# Altium schematic sheet RJ45.SchDoc: =project_title
size Tabloid; CompanyName: Luxonis Holding; Organization: Luxonis Holding; Address1: 1925 Harmony Park Drive; Address2: Westminster, CO; Address3: 80234; Address4: United States; SheetNumber: 8; SheetTotal: 12
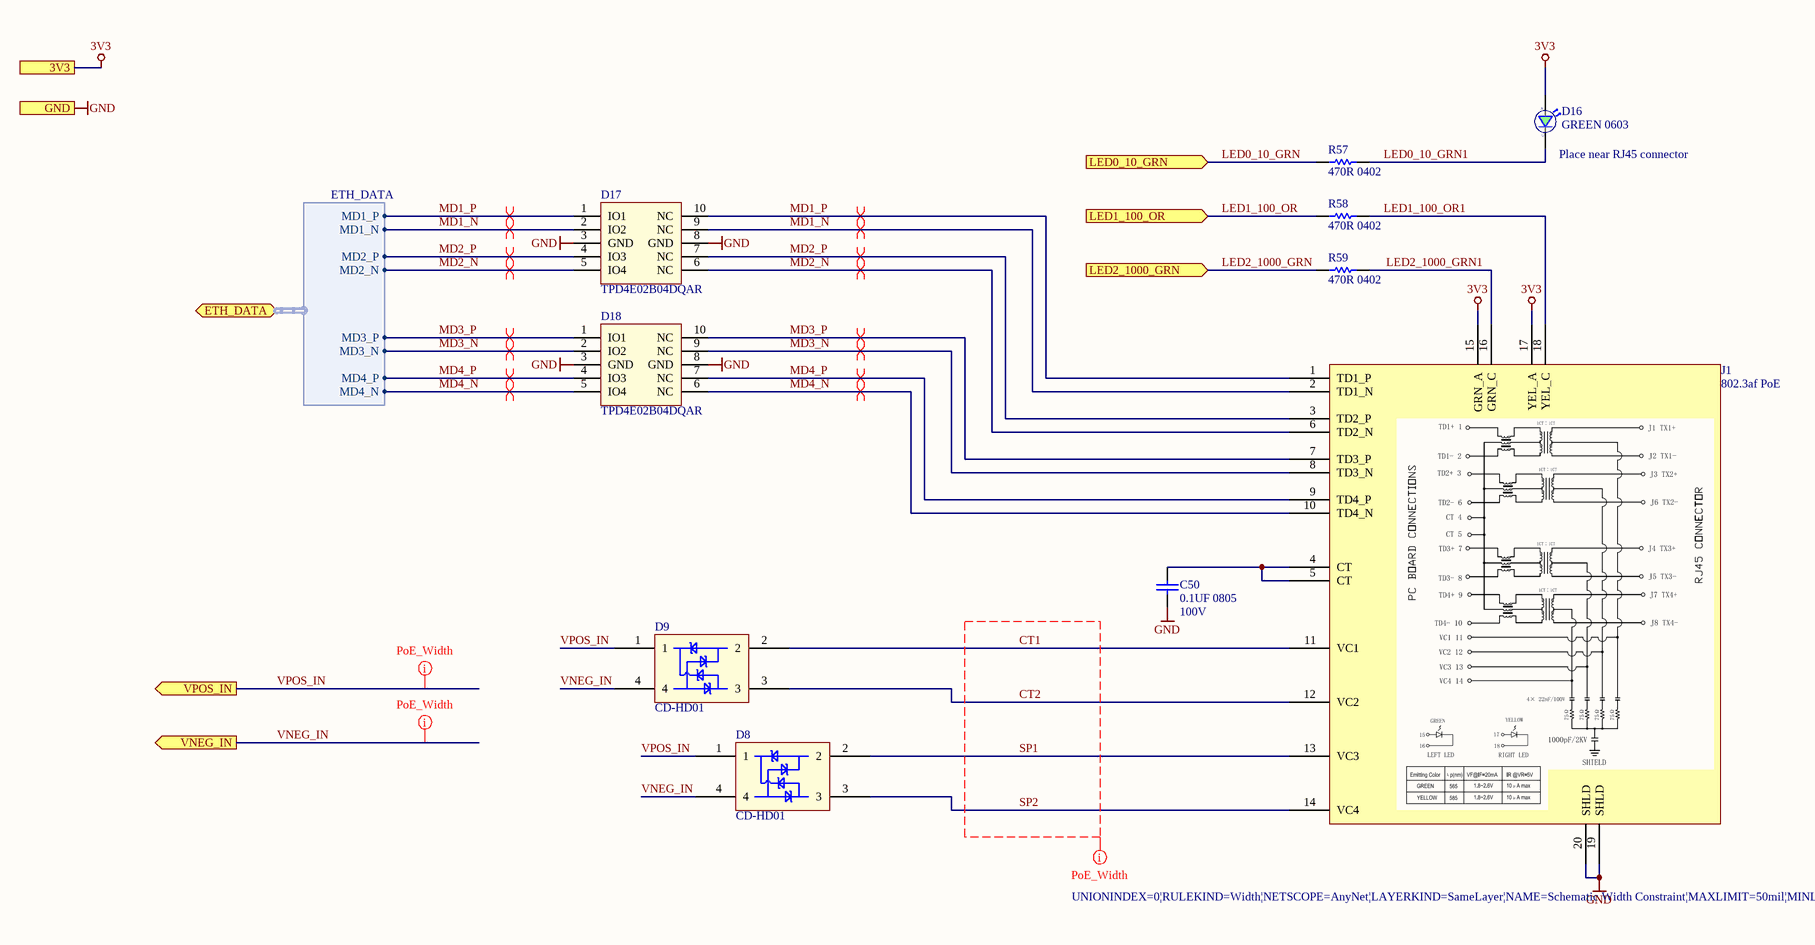
[diagram p0: RJ45.SchDoc]

## Parts
C50  0.1UF 0805  Voltage Rating: 100V  [CAPC0805(2012)145_N]
D8  CD-HD01  [CD-H01]
D9  CD-HD01  [CD-H01]
D16  GREEN 0603  [SML_D1xx8W]
D17  TPD4E02B04DQAR  [TPD4E02B04DQAR]
D18  TPD4E02B04DQAR  [TPD4E02B04DQAR]
J1  802.3af PoE  [TRJG0926HENL]
R57  470R 0402  [RESC0402(1005)_N]
R58  470R 0402  [RESC0402(1005)_N]
R59  470R 0402  [RESC0402(1005)_N]

## Ports
3V3, ETH_DATA (bidir, harness ETH_DATA), GND, LED0_10_GRN (in), LED1_100_OR (in), LED2_1000_GRN (in), VNEG_IN (out), VPOS_IN (out)

## Harnesses
ETH_DATA: MD1_P, MD1_N, MD2_P, MD2_N, MD3_P, MD3_N, MD4_P, MD4_N

## Nets
3V3: D16.2(A) J1.15(GRN_A) J1.17(YEL_A) ; port 3V3
GND: C50.1 D17.3(GND) D17.8(GND) D18.3(GND) D18.8(GND) J1.19(SHLD) J1.20(SHLD) ; port GND
CT1: D9.2 J1.11(VC1)
CT2: D9.3 J1.12(VC2)
LED0_10_GRN: R57.1 ; port LED0_10_GRN
LED0_10_GRN1: D16.1(C) R57.2
LED1_100_OR: R58.1 ; port LED1_100_OR
LED1_100_OR1: J1.18(YEL_C) R58.2
LED2_1000_GRN: R59.1 ; port LED2_1000_GRN
LED2_1000_GRN1: J1.16(GRN_C) R59.2
MD1_N: D17.2(IO2) D17.9(NC) J1.2(TD1_N) ; port ETH_DATA.MD1_N
MD1_P: D17.1(IO1) D17.10(NC) J1.1(TD1_P) ; port ETH_DATA.MD1_P
MD2_N: D17.5(IO4) D17.6(NC) J1.6(TD2_N) ; port ETH_DATA.MD2_N
MD2_P: D17.4(IO3) D17.7(NC) J1.3(TD2_P) ; port ETH_DATA.MD2_P
MD3_N: D18.2(IO2) D18.9(NC) J1.8(TD3_N) ; port ETH_DATA.MD3_N
MD3_P: D18.1(IO1) D18.10(NC) J1.7(TD3_P) ; port ETH_DATA.MD3_P
MD4_N: D18.5(IO4) D18.6(NC) J1.10(TD4_N) ; port ETH_DATA.MD4_N
MD4_P: D18.4(IO3) D18.7(NC) J1.9(TD4_P) ; port ETH_DATA.MD4_P
SP1: D8.2 J1.13(VC3)
SP2: D8.3 J1.14(VC4)
VNEG_IN: D8.4 D9.4 ; port VNEG_IN
VPOS_IN: D8.1 D9.1 ; port VPOS_IN
NetC50_2: C50.2 J1.4(CT) J1.5(CT)

## Layout directives
differential pair; net class ETH; differential pair class 100ohm: MD1_N, MD1_P, MD2_N, MD2_P, MD3_N, MD3_P, MD4_N, MD4_P
rule Width Constraint [Pref Width = 15mil    Min Width = 4mil    Max Width = 50mil]; net class PoE: CT1, CT2, SP1, SP2, VNEG_IN, VPOS_IN

## Notes on the sheet
- (near D16) Place near RJ45 connector
- Title
- Size:
- Date:
- Tabloid
- Number:
- Time:
- Revision:
- Sheet
- of
- Drawn by:

## Library data of the parts
C50 = CL21B104KCFNNNE: CAP CER 0.1UF 100V X7R 0805; Manufacturer 1: Samsung; Tolerance: 10%; Capacitance: 100nF; Supplier 1: Digi-Key; Manufacturer Part Number 1: CL21B104KCFNNNE; Stock 1: 93036; Pricing 1: 1=0.10000, 10=0.06800, 100=0.03050, 500=0.02180, 1000=0.01712 (USD); RoHS: Yes; Mount: Surface Mount; Case/Package: 0805; Case Code (Metric): 2012; Case Code (Imperial): 0805; Min Operating Temperature: -55°C; Max Operating Temperature: 125°C; Packaging: Tape and Reel; Dielectric: X7R; Length: 2mm; Width: 0.049inch; Thickness: 0.053inch; Depth: 1.25mm; Radiation Hardening: No; ComponentLink1URL: https://datasheet.ciiva.com/26936/getdatasheetpartid-781823-26936904.pdf?src-supplier=Verical; ComponentLink1Description: https://datasheet.ciiva.com/26936/getdatasheetpartid-781823-26936904.pdf?src-supplier=Verical; Supplier 2: Newark; Supplier 3: Future Electronics; Supplier Part Number 3: CL21B104KCFNNNE-CUTT; Supplier Part Number 2: 82AC9430; Supplier Part Number 1: 1276-6840-1-ND
D8 D9 = CD-HD01: CD-HD0x Series Schottky Bridge Rectifier Diode 100V 4-Pin Surface Mount T/R; Manufacturer: Bourns; Average Rectified Current: 1A; Supplier 1: Digi-Key; Manufacturer Part Number: CD-HD01; RoHS: No; Stock 1: 15383; Pricing 1: 1=0.61000, 10=0.52500, 100=0.36400, 500=0.28420, 1000=0.23100, 2000=0.21700 (USD); Mount: Surface Mount; Min Operating Temperature: -55°C; Max Operating Temperature: 125°C; Packaging: Tape and Reel; ComponentLink1URL: http://www.farnell.com/datasheets/2176057.pdf?src-supplier=Farnell; ComponentLink1Description: http://www.farnell.com/datasheets/2176057.pdf?src-supplier=Farnell; ComponentLink2URL: https://www.bourns.com/docs/Product-Datasheets/cd-hd0x.pdf?src-supplier=Digi-Key; ComponentLink2Description: https://www.bourns.com/docs/Product-Datasheets/cd-hd0x.pdf?src-supplier=Digi-Key; Supplier Part Number 1: CD-HD01CT-ND; Manufacturer 1: Bourns; Manufacturer Part Number 1: CD-HD01
D16 = SML-D12M8WT86: LED GREEN DIFFUSED 0603 SMD Green 572nm LED Indication - Discrete 2.2V 0603 (1608 Metric); Manufacturer: Rohm; Colour: Green,Yellow; Lens Colour: White,Clear,Diffused; Lens Style: Diffused,Colorless,Rectangular; Forward Current: 20mA; Luminous Intensity: 25mcd; Number of LEDs: 1; Viewing Angle: 160°; Lens Color: White,Diffused; Mount: Surface Mount; Case/Package: 0603; Number of Pins: 2; Case Code (Metric): 1608; Case Code (Imperial): 0603; Min Operating Temperature: -40°C; Max Operating Temperature: 85°C; Forward Voltage: 2.2V; Packaging: Tape and Reel; Dominant Wavelength: 572nm; Wavelength: 572nm; Illumination Colour: Green; Package Quantity: 1; Test Current: 20mA; Lens Transparency: Diffused; Length: 1.6mm; Height: 0.65mm; Width: 0.8mm; Radiation Hardening: No; REACH SVHC: Unknown; Lead Free: Lead Free; ComponentLink1URL: https://datasheet.ciiva.com/11774/0900766b80df3ada-11774260.pdf; ComponentLink1Description: https://datasheet.ciiva.com/11774/0900766b80df3ada-11774260.pdf; ComponentLink2URL: https://datasheet.ciiva.com/3161/sml-d1-3161419.pdf; ComponentLink2Description: https://datasheet.ciiva.com/3161/sml-d1-3161419.pdf; ComponentLink3URL: https://datasheet.ciiva.com/2110/sml-d1-2110396.pdf; ComponentLink3Description: https://datasheet.ciiva.com/2110/sml-d1-2110396.pdf; ComponentLink4URL: https://datasheet.ciiva.com/2110/sml-d1-2110397.pdf; ComponentLink4Description: https://datasheet.ciiva.com/2110/sml-d1-2110397.pdf; ComponentLink5URL: https://datasheet.ciiva.com/2110/sml-d1-2110398.pdf; ComponentLink5Description: https://datasheet.ciiva.com/2110/sml-d1-2110398.pdf; Manufacturer Part Number: SML-D12M8WT86; Supplier 1: Digi-Key; Manufacturer 1: Rohm; Manufacturer Part Number 1: SML-D12M8WT86; Stock 1: 112971; Pricing 1: 1=0.33000, 10=0.23900, 100=0.11340, 500=0.07560, 1000=0.05922 (USD); RoHS: Yes; Color: Green,Yellow; Illumination Color: Green; ComponentLink6URL: https://datasheet.ciiva.com/11774/0900766b80df3ada-11774260.pdf?src-supplier=RSComponents; ComponentLink6Description: https://datasheet.ciiva.com/11774/0900766b80df3ada-11774260.pdf?src-supplier=RSComponents; ComponentLink7URL: https://datasheet.ciiva.com/3161/sml-d1-3161419.pdf?src-supplier=Avnet; ComponentLink7Description: https://datasheet.ciiva.com/3161/sml-d1-3161419.pdf?src-supplier=Avnet; ComponentLink8URL: https://datasheet.ciiva.com/2110/sml-d1-2110396.pdf?src-supplier=Digi-Key; ComponentLink8Description: https://datasheet.ciiva.com/2110/sml-d1-2110396.pdf?src-supplier=Digi-Key; ComponentLink9URL: https://datasheet.ciiva.com/2110/sml-d1-2110397.pdf?src-supplier=Digi-Key; ComponentLink9Description: https://datasheet.ciiva.com/2110/sml-d1-2110397.pdf?src-supplier=Digi-Key; ComponentLink10URL: https://datasheet.ciiva.com/2110/sml-d1-2110398.pdf?src-supplier=Digi-Key; ComponentLink10Description: https://datasheet.ciiva.com/2110/sml-d1-2110398.pdf?src-supplier=Digi-Key; Supplier Part Number 1: 511-1578-1-ND
D17 D18 = TPD4E02B04DQAR: TVS DIODE 3.6V 8.8V 10USON 8.8V (Typ) Clamp 5A (8/20µs) Ipp Tvs Diode Surface Mount 10-USON (2.5x1); Manufacturer 1: Texas Instruments; Number of Bidirectional Channels: 4; Min Breakdown Voltage: 5.5V; Peak Pulse Power: 17W; Power Line Protection: No; Interface: USB,HDMI; Supplier 1: Digi-Key; Manufacturer Part Number 1: TPD4E02B04DQAR; Stock 1: 25615; Pricing 1: 1=0.69000, 10=0.60800, 100=0.46650, 500=0.36874, 1000=0.29499 (USD); RoHS: Yes; Mount: Surface Mount; Number of Pins: 10; Min Operating Temperature: -40°C; Max Operating Temperature: 125°C; Packaging: Cut Tape; Reverse Standoff Voltage: 3.6V; Clamping Voltage: 8.8V; Operating Supply Voltage: 3.6V; Peak Pulse Current: 5A; Number of Channels: 4; Composition: Zener; REACH SVHC: No SVHC; Lead Free: Lead Free; ComponentLink1URL: http://www.ti.com/general/docs/lit/getliterature.tsp?genericPartNumber=TPD4E02B04&amp;&amp;fileType=pdf&src-supplier=Element14; ComponentLink1Description: http://www.ti.com/general/docs/lit/getliterature.tsp?genericPartNumber=TPD4E02B04&amp;&amp;fileType=pdf&src-supplier=Element14; ComponentLink2URL: http://www.ti.com/lit/ds/symlink/tpd4e02b04.pdf?src-supplier=Farnell; ComponentLink2Description: http://www.ti.com/lit/ds/symlink/tpd4e02b04.pdf?src-supplier=Farnell; ComponentLink3URL: http://www.ti.com/lit/ds/symlink/tpd4e02b04.pdf?src-supplier=Newark; ComponentLink3Description: http://www.ti.com/lit/ds/symlink/tpd4e02b04.pdf?src-supplier=Newark; ComponentLink4URL: http://www.ti.com/lit/ds/symlink/tpd4e02b04.pdf?src-supplier=Digi-Key; ComponentLink4Description: http://www.ti.com/lit/ds/symlink/tpd4e02b04.pdf?src-supplier=Digi-Key; Supplier Part Number 1: 296-43875-1-ND
J1 = TRJG0926HENL: CONN MAGJACK 1PORT 1000 BASET; Manufacturer 1: Trxcom; System: Connector; Manufacturer Part Number 1: TRJG0926HENL; Supplier 1: Trxcom; Supplier Part Number 1: TRJG0926HENL
R57-R59 = CRCW0402470RFKED: RES SMD 470 OHM 1% 1/16W 0402; Manufacturer 1: Vishay; Temperature Coefficient: 100ppm/°C; Power Rating: 63mW; Voltage Rating: 50V; Supplier 1: Digi-Key; Manufacturer Part Number 1: CRCW0402470RFKED; Stock 1: 9199; Pricing 1: 1=0.10000, 10=0.03800, 100=0.01540, 1000=0.00690, 2500=0.00599, 5000=0.00495 (USD); RoHS: Yes; Case/Package: 0402; Weight: 2.3E-05oz; Case Code (Imperial): 0402; Case Code (Metric): 1005; Min Operating Temperature: -55°C; Max Operating Temperature: 155°C; Packaging: Tape and Reel; Resistance: 470R; Tolerance: 1%; Composition: Thick Film; Voltage Rating (DC): 50V; Termination: SMD/SMT; Military Standard: Not; Length: 1mm; Height: 0.35mm; Width: 0.5mm; Depth: 0.5mm; Lead Free: Lead Free; ComponentLink1URL: https://datasheet.ciiva.com/11811/0900766b80d98824-11811416.pdf?src-supplier=RSComponents; ComponentLink1Description: https://datasheet.ciiva.com/11811/0900766b80d98824-11811416.pdf?src-supplier=RSComponents; Supplier 2: Newark; Supplier Part Number 1: 541-470LCT-ND; Supplier Part Number 2: 26W9133; Mount: Surface Mount; Contact Plating: Tin; Number of Terminations: 2; Package Quantity: 10; Max Power Dissipation: 63mW; Features: Automotive AEC-Q200; Radiation Hardening: No; REACH SVHC: Unknown; ComponentLink2URL: https://datasheet.ciiva.com/16764/70201119-16764886.pdf?src-supplier=Allied+Electronics; ComponentLink2Description: https://datasheet.ciiva.com/16764/70201119-16764886.pdf?src-supplier=Allied+Electronics; ComponentLink3URL: https://datasheet.ciiva.com/28613/1720486-28613479.pdf?src-supplier=Element14; ComponentLink3Description: https://datasheet.ciiva.com/28613/1720486-28613479.pdf?src-supplier=Element14; ComponentLink4URL: https://datasheet.ciiva.com/3256/dcrcwe3-3256553.pdf?src-supplier=Avnet; ComponentLink4Description: https://datasheet.ciiva.com/3256/dcrcwe3-3256553.pdf?src-supplier=Avnet; ComponentLink5URL: https://datasheet.ciiva.com/7777/1720486-7777243.pdf?src-supplier=Element14; ComponentLink5Description: https://datasheet.ciiva.com/7777/1720486-7777243.pdf?src-supplier=Element14; ComponentLink6URL: https://datasheet.ciiva.com/8336/dcrcwe3-8336715.pdf?src-supplier=Avnet; ComponentLink6Description: https://datasheet.ciiva.com/8336/dcrcwe3-8336715.pdf?src-supplier=Avnet; ComponentLink7URL: https://datasheet.ciiva.com/7777/1697337-7777244.pdf?src-supplier=Element14; ComponentLink7Description: https://datasheet.ciiva.com/7777/1697337-7777244.pdf?src-supplier=Element14; ComponentLink8URL: https://datasheet.ciiva.com/2463/dcrcwe3-2463085.pdf?src-supplier=Digi-Key; ComponentLink8Description: https://datasheet.ciiva.com/2463/dcrcwe3-2463085.pdf?src-supplier=Digi-Key; ComponentLink9URL: https://datasheet.ciiva.com/16362/dcrcwe3-16362109.pdf?src-supplier=Future+Electronics; ComponentLink9Description: https://datasheet.ciiva.com/16362/dcrcwe3-16362109.pdf?src-supplier=Future+Electronics; ComponentLink10URL: https://datasheet.ciiva.com/16882/dcrcwe3-16882493.pdf?src-supplier=Avnet+Europe; ComponentLink10Description: https://datasheet.ciiva.com/16882/dcrcwe3-16882493.pdf?src-supplier=Avnet+Europe; ComponentLink11URL: https://datasheet.ciiva.com/2463/dcrcwe3-2463086.pdf?src-supplier=Digi-Key; ComponentLink11Description: https://datasheet.ciiva.com/2463/dcrcwe3-2463086.pdf?src-supplier=Digi-Key; ComponentLink12URL: https://datasheet.ciiva.com/2463/dcrcwe3-2463087.pdf?src-supplier=Digi-Key; ComponentLink12Description: https://datasheet.ciiva.com/2463/dcrcwe3-2463087.pdf?src-supplier=Digi-Key